# EAGLE design 1-con (EAGLE 5.06)
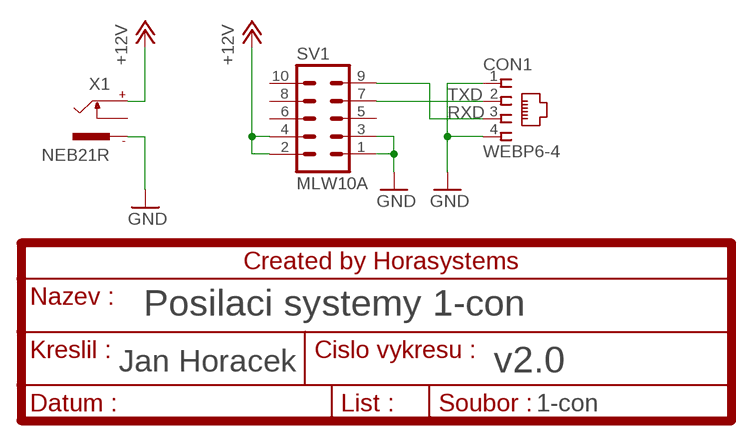
[diagram p0: schematic, sheet 1]

## Parts
CON1  WEBP6-4  [WEBP6-4]
SV1  MLW10A  ML10L  [ML10L]
X1  NEB21R  [NEB21R]

## Nets
+12V: SV1.2 SV1.4 X1.+
GND: CON1.1 CON1.4 SV1.1 SV1.3 X1.-
RXD: CON1.3 SV1.9
TXD: CON1.2 SV1.7
Unconnected: SV1.5 SV1.6 SV1.8 SV1.10 X1.C

## Notes on the sheet
- Posilaci systemy 1-con
- v2.0

## Library data of the parts
CON1 = con-malina:WEBP6-4
SV1 = con-ml:ML10L: HARTING
X1 = con-lumberg:NEB21R: Klinkeneinbaukupplung

## Board
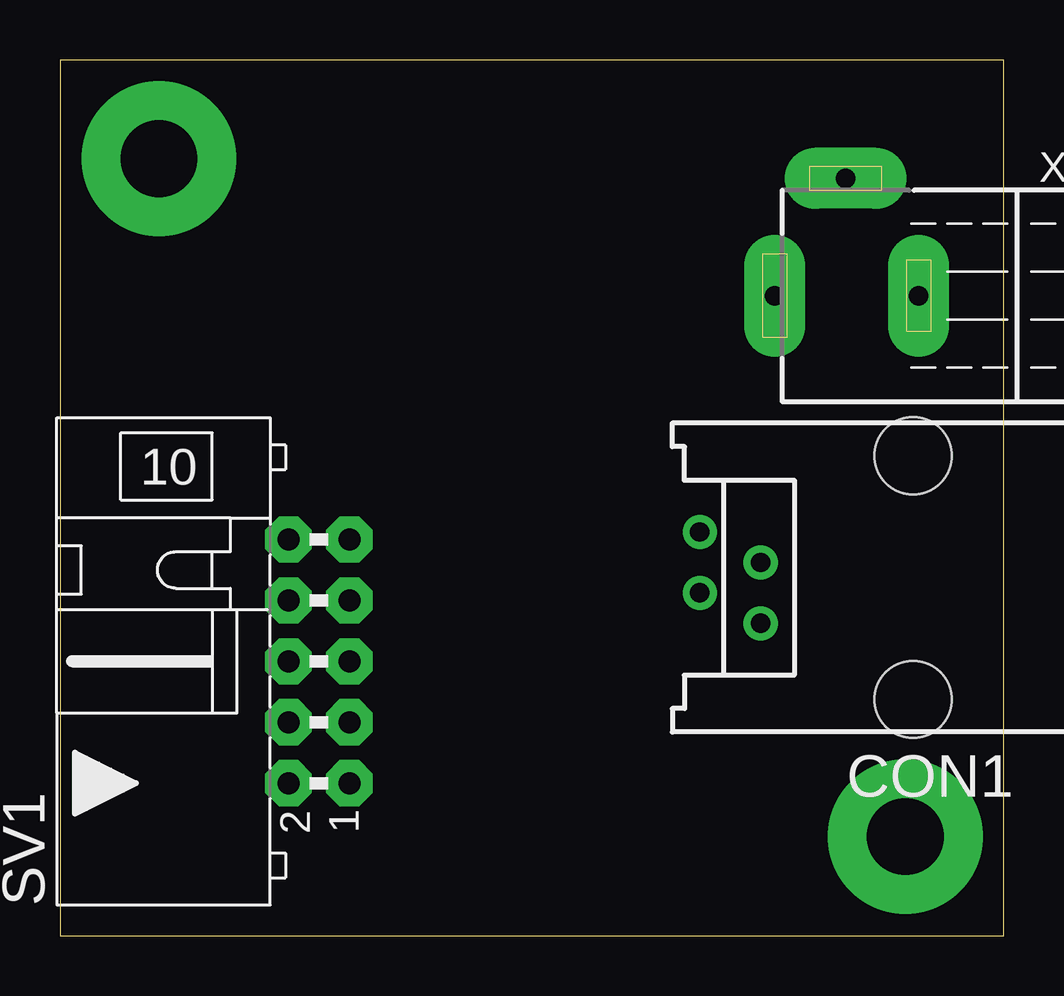
[diagram p1: board, top side]
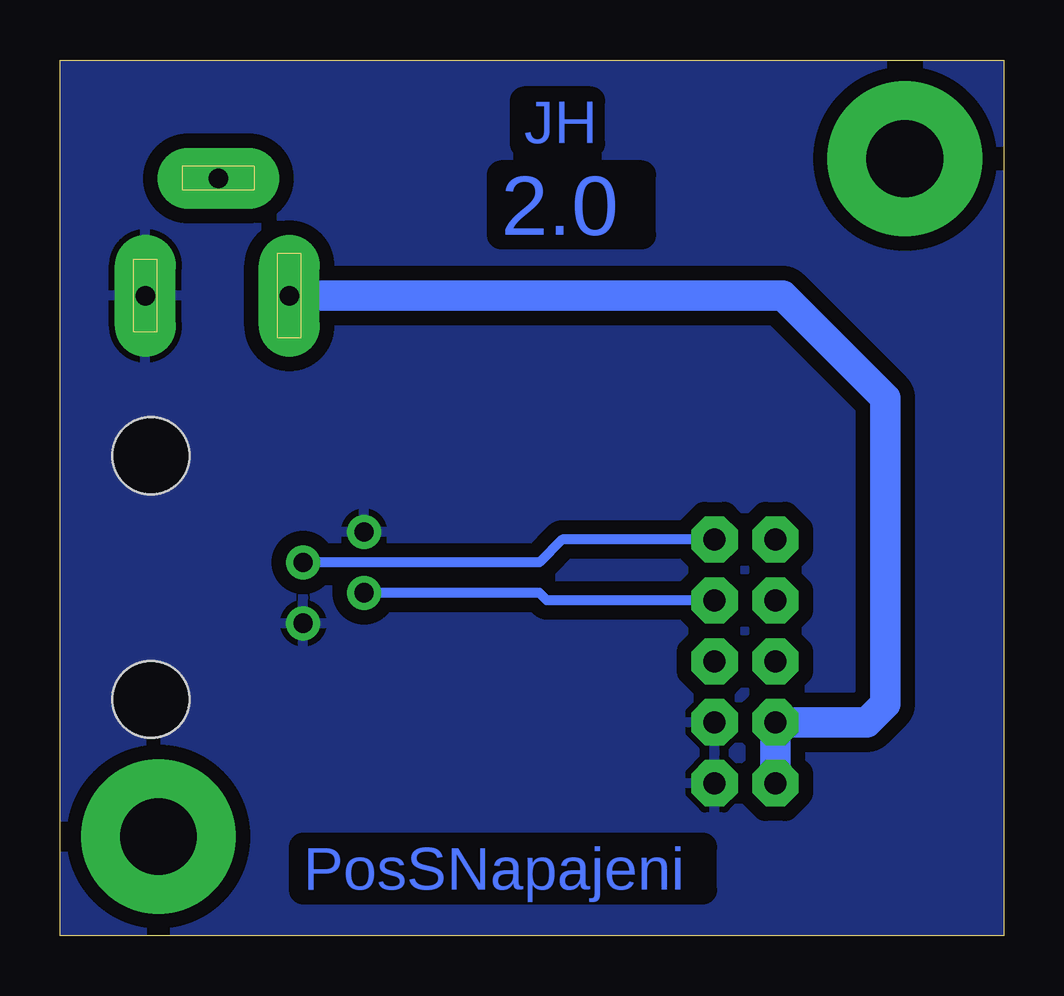
[diagram p2: board, bottom side, seen from below]

Size 39.35 x 36.5 mm. Coordinates in mm from the lower left corner, seen from the top.
Outline: 0,0 39.35,0 39.35,36.5 0,36.5 0,0
Copper layers (1*16): Top 0.035mm / dielectric 1.5mm / Bottom 0.035mm
Design rules "default *": minimum track width 10mil, minimum drill 24mil, track to track 0.6mm, track to pad 0.6mm, pad to pad 0.6mm, via to via 0.4mm, smd to smd 0.6mm, copper to edge 1mil, drill to drill 8mil, minimum pad ring 10mil, minimum via ring 8mil, stop-mask expansion 4mil, vias tented up to drill 0mil, thermal gap 10mil

### Footprints (pad centres in the part's own frame; a part is rotated, then mirrored left to right if it is on the bottom)
WEBP6-4 = drill 0.8 pad 1.422 round: 1 -1.905,6.35; 2 -0.635,8.89; 3 0.635,6.35; 4 1.905,8.89 | hole 3.2: -5.08,0; 5.08,0
ML10L = drill 0.914 pad 1.93 octagon: 1 -5.08,-1.27; 2 -5.08,1.27; 3 -2.54,-1.27; 4 -2.54,1.27; 5 0,-1.27; 6 0,1.27; 7 2.54,-1.27; 8 2.54,1.27; 9 5.08,-1.27; 10 5.08,1.27
NEB21R = drill 0.813 pad 2.54 long: + 0,7.35; - 0,1.35; C 4.9,4.4

### Placement (x,y rotation side)
CON1  35.56,14.92 90 top
SV1  10.79,11.43 90 top
X1  37.15,26.67 90 top

### Tracks (layer width: path | path; a pad name or v marks a point on that pad's centre or on a via)
+12V
  Bottom 1.27: SV1.2 SV1.4 5.71,8.89 4.95,9.65 4.95,22.41 9.21,26.67 X1.+
GND
  pour Bottom: 0,0 0,36.51 39.37,36.51 39.37,0
N$1  (via drill 3.2 pad 6.45)
  other vias: 4.13,32.38
N$2  (via drill 3.2 pad 6.45)
  other vias: 35.24,4.13
RXD
  Bottom 0.406: SV1.9 18.41,16.51 19.37,15.56 CON1.3
TXD
  Bottom 0.406: SV1.7 19.05,13.97 19.37,14.29 CON1.2

### Text on the board
Bottom: JH | 2.0 | PosSNapajeni